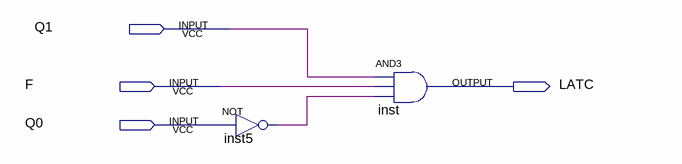
[diagram p0: schematic sheet]
// Quartus schematic latc.bdf as structural Verilog: 2 symbols, 4 pins
module latc (
  input  Q1,
  input  F,
  input  Q0,
  output LATC
);

  wire inst5_out;

  not inst5 (inst5_out, Q0);
  and inst (LATC, Q1, F, inst5_out);
endmodule
